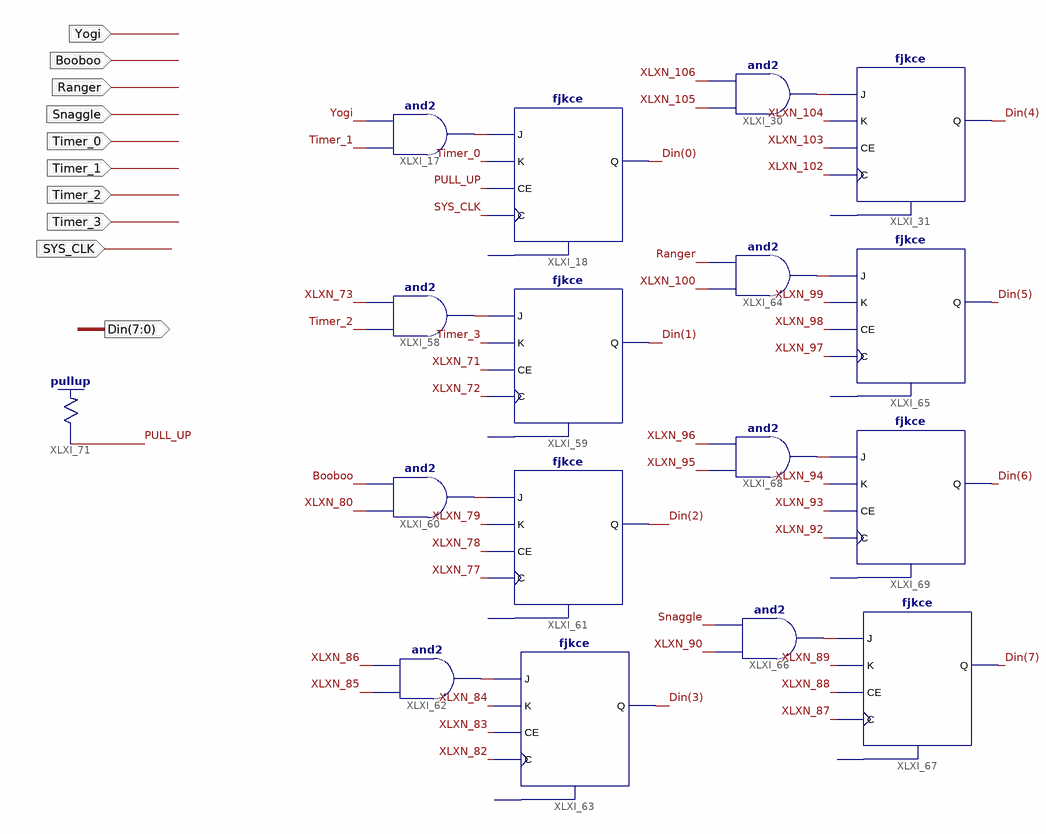
[diagram p0: schematic sheet 1]
// Xilinx ISE schematic YBRS.sch (spartan3e) as structural Verilog: 17 symbols, 10 ports
module YBRS (
  input  Yogi,
  input  Timer_1,
  input  Timer_0,
  input  SYS_CLK,
  input  Timer_3,
  input  Timer_2,
  input  Booboo,
  input  Snaggle,
  input  Ranger,
  output [7:0] Din
);

  wire PULL_UP, XLXN_57, XLXN_64, XLXN_71, XLXN_72, XLXN_73, XLXN_77, XLXN_78, XLXN_79, XLXN_80, XLXN_82,
       XLXN_83, XLXN_84, XLXN_85, XLXN_86, XLXN_87, XLXN_88, XLXN_89, XLXN_90, XLXN_92, XLXN_93, XLXN_94,
       XLXN_95, XLXN_96, XLXN_97, XLXN_98, XLXN_99, XLXN_100, XLXN_102, XLXN_103, XLXN_104, XLXN_105,
       XLXN_106, XLXN_181, XLXN_182, XLXN_183, XLXN_184, XLXN_185, XLXN_186;

  and XLXI_17 (XLXN_57, Timer_1, Yogi);
  fjkce XLXI_18 (.C(SYS_CLK), .CE(PULL_UP), .J(XLXN_57), .K(Timer_0), .Q(Din[0]));  // open: CLR
  and XLXI_58 (XLXN_181, Timer_2, XLXN_73);
  fjkce XLXI_59 (.C(XLXN_72), .CE(XLXN_71), .J(XLXN_181), .K(Timer_3), .Q(Din[1]));  // open: CLR
  and XLXI_60 (XLXN_182, XLXN_80, Booboo);
  fjkce XLXI_61 (.C(XLXN_77), .CE(XLXN_78), .J(XLXN_182), .K(XLXN_79), .Q(Din[2]));  // open: CLR
  and XLXI_62 (XLXN_183, XLXN_85, XLXN_86);
  fjkce XLXI_63 (.C(XLXN_82), .CE(XLXN_83), .J(XLXN_183), .K(XLXN_84), .Q(Din[3]));  // open: CLR
  and XLXI_66 (XLXN_185, XLXN_90, Snaggle);
  fjkce XLXI_67 (.C(XLXN_87), .CE(XLXN_88), .J(XLXN_185), .K(XLXN_89), .Q(Din[7]));  // open: CLR
  and XLXI_68 (XLXN_186, XLXN_95, XLXN_96);
  and XLXI_64 (XLXN_184, XLXN_100, Ranger);
  fjkce XLXI_69 (.C(XLXN_92), .CE(XLXN_93), .J(XLXN_186), .K(XLXN_94), .Q(Din[6]));  // open: CLR
  fjkce XLXI_65 (.C(XLXN_97), .CE(XLXN_98), .J(XLXN_184), .K(XLXN_99), .Q(Din[5]));  // open: CLR
  fjkce XLXI_31 (.C(XLXN_102), .CE(XLXN_103), .J(XLXN_64), .K(XLXN_104), .Q(Din[4]));  // open: CLR
  and XLXI_30 (XLXN_64, XLXN_105, XLXN_106);
  \pullup  XLXI_71 (.O(PULL_UP));
endmodule
